# EAGLE schematic Motherboard_simple (EAGLE 6.3)
DATABASE: ./../../../eagle/PARTSDB.TXT
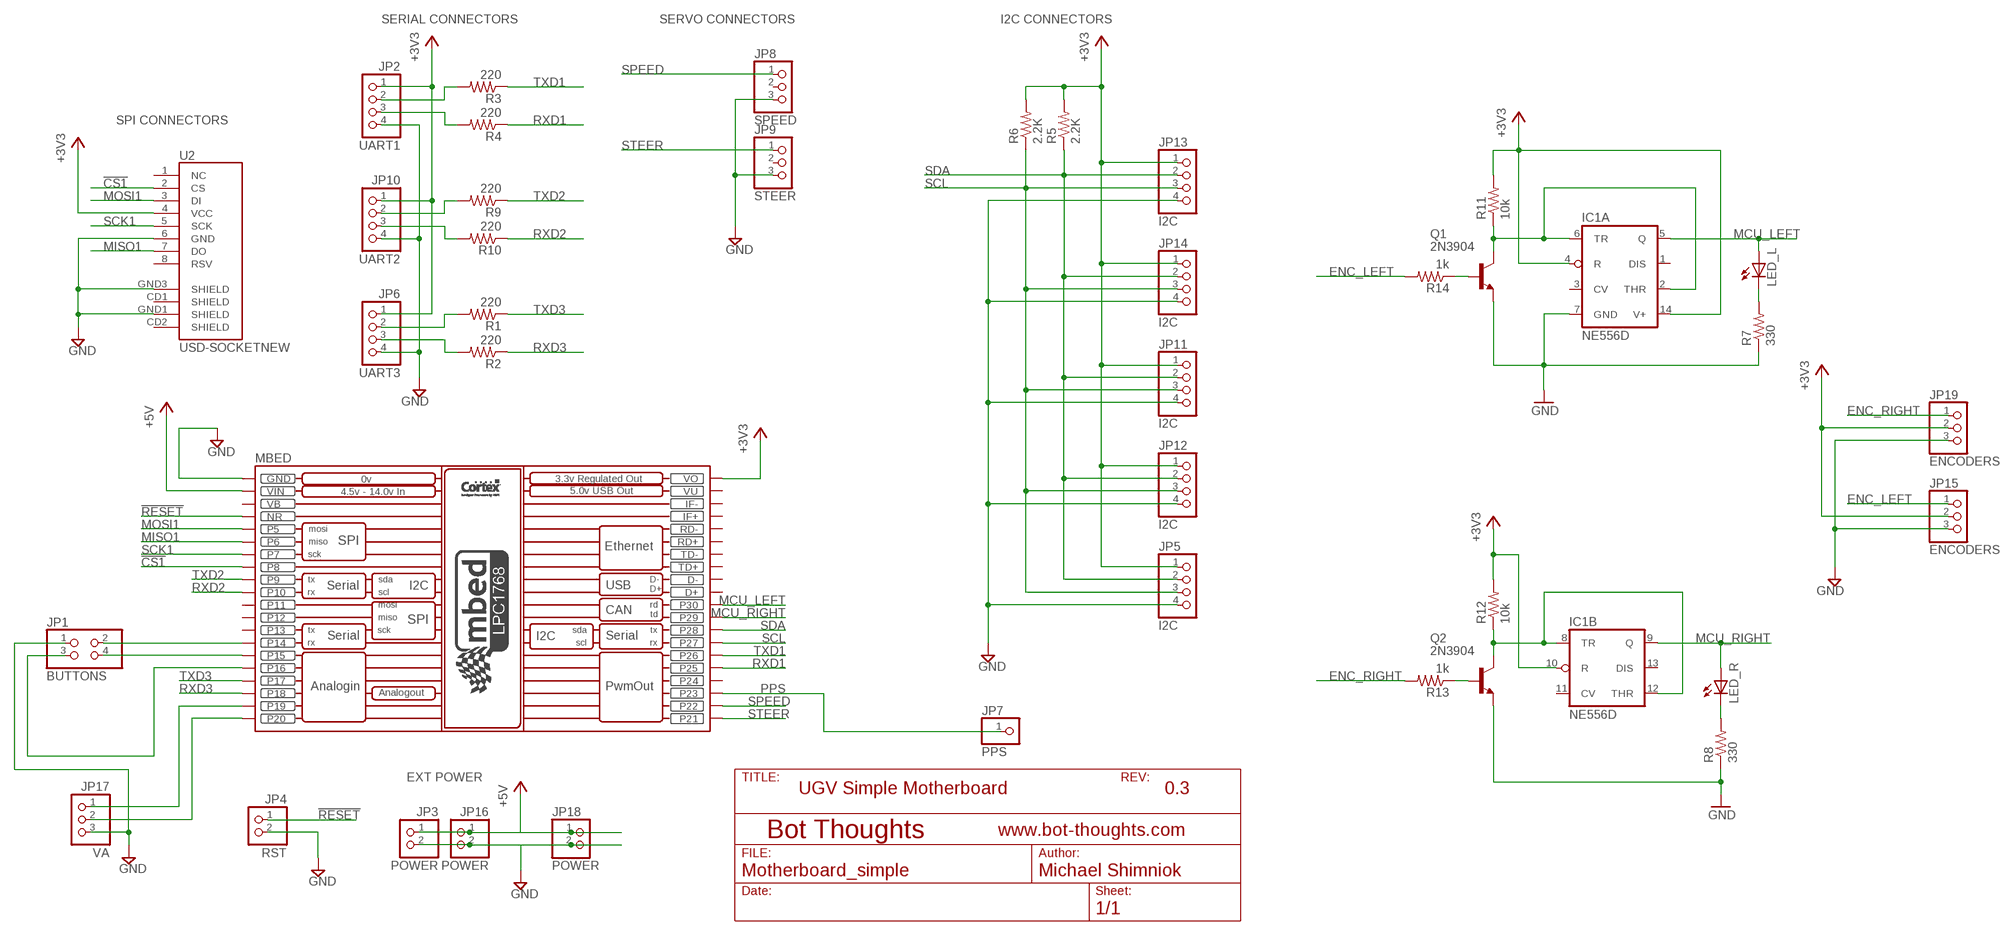
[diagram p0: schematic, sheet 1]

## Parts
IC1  NE556D  [SO14]
JP1  BUTTONS  PINHD-2X02_2.54  [2X02]
JP2  UART1  PINHD-1X04_2.54-S  [1X04-S]
JP3  POWER  PINHD-1X02_2.54-S  [1X02-S]
JP4  RST  PINHD-1X02_2.54-S  [1X02-S]
JP5  I2C  PINHD-1X04_2.54-S  [1X04-S]
JP6  UART3  PINHD-1X04_2.54-S  [1X04-S]
JP7  PPS  PINHD-1X01_2.54-S  [1X01-S]
JP8  SPEED  PINHD-1X03_2.54-S  [1X03-S]
JP9  STEER  PINHD-1X03_2.54-S  [1X03-S]
JP10  UART2  PINHD-1X04_2.54-S  [1X04-S]
JP11  I2C  PINHD-1X04_2.54-S  [1X04-S]
JP12  I2C  PINHD-1X04_2.54-S  [1X04-S]
JP13  I2C  PINHD-1X04_2.54-S  [1X04-S]
JP14  I2C  PINHD-1X04_2.54-S  [1X04-S]
JP15  ENCODERS  PINHD-1X03_2.54-S  [1X03-S]
JP16  POWER  PINHD-1X02_2.54-S  [1X02-S]
JP17  VA  PINHD-1X03_2.54-S  [1X03-S]
JP18  POWER  PINHD-1X02_2.54-S  [1X02-S]
JP19  ENCODERS  PINHD-1X03_2.54-S  [1X03-S]
LED_L  LED3MM  [LED3MM]
LED_R  LED3MM  [LED3MM]
MBED  MBED_NXP_LPC1768  [MBED-KIT]
Q1  2N3904  2N3904INLINE  [TO92-CBE]
Q2  2N3904  2N3904INLINE  [TO92-CBE]
R1  220  R-US_0204/5  [0204/5]
R2  220  R-US_0204/5  [0204/5]
R3  220  R-US_0204/5  [0204/5]
R4  220  R-US_0204/5  [0204/5]
R5  2.2K  R-US_0204/5  [0204/5]
R6  2.2K  R-US_0204/5  [0204/5]
R7  330  R-US_0204/5  [0204/5]
R8  330  R-US_0204/5  [0204/5]
R9  220  R-US_0204/5  [0204/5]
R10  220  R-US_0204/5  [0204/5]
R11  10k  R-US_0204/5  [0204/5]
R12  10k  R-US_0204/5  [0204/5]
R13  1k  R-US_0204/5  [0204/5]
R14  1k  R-US_0204/5  [0204/5]
U2  USD-SOCKETNEW  [MICRO-SD-SOCKET-PP]

## Nets
!CS1: MBED.P$8(P8) U2.2(CS)
!RESET: JP4.1 MBED.NR
+3V3: IC1.4(A:R) IC1.10(B:R) IC1.14(A:V+) JP2.1 JP5.1 JP6.1 JP10.1 JP11.1 JP12.1 JP13.1 JP14.1 JP15.2 JP19.2 MBED.VOUT(VO) R5.2 R6.2 R11.2 R12.2 U2.4(VCC)
+5V: JP3.1 JP16.1 JP18.1 MBED.VIN
AMP: JP17.2 MBED.P$20(P20)
ENC_LEFT: JP15.1 R14.2
ENC_RIGHT: JP19.1 R13.2
GND: IC1.7(A:GND) JP1.1 JP2.4 JP3.2 JP4.2 JP5.4 JP6.4 JP8.3 JP9.3 JP10.4 JP11.4 JP12.4 JP13.4 JP14.4 JP15.3 JP16.2 JP17.3 JP18.2 JP19.3 MBED.GND Q1.E Q2.E R7.1 R8.1 U2.6(GND) U2.GND1(SHIELD) U2.GND3(SHIELD)
MCU_LEFT: IC1.5(A:Q) LED_L.A MBED.P$30(P30)
MCU_RIGHT: IC1.9(B:Q) LED_R.A MBED.P$29(P29)
MISO1: MBED.P$6(P6) U2.7(DO)
MOSI1: MBED.P$5(P5) U2.3(DI)
N$1: JP6.2 R1.2
N$2: JP6.3 R2.2
N$3: LED_L.K(C) R7.2
N$4: LED_R.K(C) R8.2
N$5: JP1.2 MBED.P$14(P14)
N$6: JP17.1 MBED.P$19(P19)
N$7: JP1.4 MBED.P$15(P15)
N$8: JP1.3 MBED.P$16(P16)
N$9: JP2.2 R3.2
N$10: JP2.3 R4.2
N$11: IC1.8(B:TR) IC1.12(B:THR) Q2.C R12.1
N$12: IC1.2(A:THR) IC1.6(A:TR) Q1.C R11.1
N$13: Q2.B R13.1
N$14: Q1.B R14.1
N$16: JP10.2 R9.2
N$17: JP10.3 R10.2
PPS: JP7.1 MBED.P$23(P23)
RXD1: MBED.P$25(P25) R4.1
RXD2: MBED.P$10(P10) R10.1
RXD3: MBED.P$18(P18) R2.1
SCK1: MBED.P$7(P7) U2.5(SCK)
SCL: JP5.3 JP11.3 JP12.3 JP13.3 JP14.3 MBED.P$27(P27) R6.1
SDA: JP5.2 JP11.2 JP12.2 JP13.2 JP14.2 MBED.P$28(P28) R5.1
SPEED: JP8.1 MBED.P$22(P22)
STEER: JP9.1 MBED.P$21(P21)
TXD1: MBED.P$26(P26) R3.1
TXD2: MBED.P$9(P9) R9.1
TXD3: MBED.P$17(P17) R1.1
Unconnected: IC1.1(A:DIS) IC1.3(A:CV) IC1.11(B:CV) IC1.13(B:DIS) JP8.2 JP9.2 MBED.D+ MBED.D- MBED.IF+ MBED.IF- MBED.P$11(P11) MBED.P$12(P12) MBED.P$13(P13) MBED.P$24(P24) MBED.RD+ MBED.RD- MBED.TD+ MBED.TD- U2.1(NC) U2.8(RSV) U2.CD1(SHIELD) U2.CD2(SHIELD)

## Notes on the sheet
- SERIAL CONNECTORS | SERVO CONNECTORS | I2C CONNECTORS
- SPI CONNECTORS
- EXT POWER
- UGV Simple Motherboard | 0.3

## Power pins joined to a net without a drawn wire
VB: MBED.VB
VU: MBED.VU

## Library data of the parts
IC1 = linear:*556: Dual TIMER
JP1 = pinhead-2:PINHD-2X02: PIN HEADER
JP2 JP5 JP6 JP10-JP14 = pinhead-2:PINHD-1X04: PIN HEADER; OC_NEWARK: unknown
JP3 JP4 JP16 JP18 = pinhead-2:PINHD-1X02: PIN HEADER; OC_NEWARK: unknown
JP7 = pinhead-2:PINHD-1X01: PIN HEADER
JP8 JP9 JP15 JP17 JP19 = pinhead-2:PINHD-1X03: PIN HEADER; OC_NEWARK: unknown
LED_L LED_R = led:LED: LED OSRAM: - CHIPLED LG R971, LG N971, LY N971, LG Q971, LY Q971, LO R971, LY R971 LH N974, LH R974 LS Q976, LO Q976, LY Q976 LO Q996 - Hyper CHIPLED LW Q18S LB Q993, LB Q99A, LB R99A - SideLED LS A670, LO A670, LY A670, LG A670, LP A670 LB A673, LV A673, LT A673, LW A673 LH A674 LY A675 LS A676, LA A676, LO A676, LY A676, LW A676 LS A679, LY A679, LG A679 - Hyper Micro SIDELED® LS Y876, LA Y876, LO Y876, LY Y876 LT Y87S - SmartLED LW L88C, LW L88S LB L89C, LB L89S, LG L890 LS L89K, LO L89K, LY L89K LS L896, LA L896, LO L896, LY L896 - TOPLED LS T670, LO T670, LY T670, LG T670, LP T670 LSG T670, LSP T670, LSY T670, LOP T670, LYG T670 LG T671, LOG T671, LSG T671 LB T673, LV T673, LT T673, LW T673 LH T674 LS T676, LA T676, LO T676, LY T676, LB T676, LH T676, LSB T676, LW T676 LB T67C, LV T67C, LT T67C, LS T67K, LO T67K, LY T67K, LW E67C LS E67B, LA E67B, LO E67B, LY E67B, LB E67C, LV E67C, LT E67C LW T67C LS T679, LY T679, LG T679 LS T770, LO T770, LY T770, LG T770, LP T770 LB T773, LV T773, LT T773, LW T773 LH T774 LS E675, LA E675, LY E675, LS T675 LS T776, LA T776, LO T776, LY T776, LB T776 LHGB T686 LT T68C, LB T68C - Hyper Mini TOPLED® LB M676 - Mini TOPLED Santana® LG M470 LS M47K, LO M47K, LY M47K Source: http://www.osram.convergy.de LUXEON: - LUMILED® LXK2-PW12-R00, LXK2-PW12-S00, LXK2-PW14-U00, LXK2-PW14-V00 LXK2-PM12-R00, LXK2-PM12-S00, LXK2-PM14-U00 LXK2-PE12-Q00, LXK2-PE12-R00, LXK2-PE12-S00, LXK2-PE14-T00, LXK2-PE14-U00 LXK2-PB12-K00, LXK2-PB12-L00, LXK2-PB12-M00, LXK2-PB14-N00, LXK2-PB14-P00, LXK2-PB14-Q00 LXK2-PR12-L00, LXK2-PR12-M00, LXK2-PR14-Q00, LXK2-PR14-R00 LXK2-PD12-Q00, LXK2-PD12-R00, LXK2-PD12-S00 LXK2-PH12-R00, LXK2-PH12-S00 LXK2-PL12-P00, LXK2-PL12-Q00, LXK2-PL12-R00 Source: www.luxeon.com KINGBRIGHT: KA-3528ASYC Source: www.kingbright.com
MBED = MBED_v2.1:MBED_NXP_LPC1768: Mbed LPC1768 - ARM CORTEX v2.1 * Schematic symbol is now placed in eagles's default raster. *The pads diameter are suitable for routing between mbed pins * mbed pads are 0.8 mm drill diameter. --------------------------------------------- Created by: Mohamed Yousry *Alexandria, Egypt *Email: mohamed.yousry@ieeegoldegypt.org; MPN: 2212S-20SG-85; OC_NEWARK: 08N6778
Q1 Q2 = mes_transistors:2N3904: NPN Transistor Small signal NPN Bipolar Junction Transistor (BJT). Use this device to represent any of a number of such transistors with similar package and pinout: 2N4401, 2N3904, 2N2222, etc.
R1-R4 R9 R10 = rcl:R-US_: RESISTOR, American symbol; MPN: WCR0805-220RFI; OC_NEWARK: 98K2621
R5 R6 = rcl:R-US_: RESISTOR, American symbol; OC_NEWARK: unknown
R7 R8 R11-R14 = rcl:R-US_: RESISTOR, American symbol
U2 = SparkFun:USD-SOCKET: microSD Socket Push-push type uSD socket. Schematic element and footprint production proven. Spark Fun Electronics SKU : PRT-00127. tDoc lines correctly indicate media card edge positions when inserting (unlocked, locked, depressed).